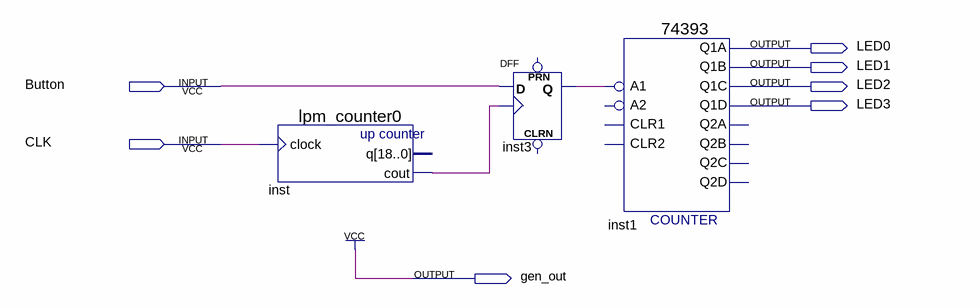
[diagram p0: schematic sheet]
// Quartus schematic 31.bdf as structural Verilog: 3 symbols, 7 pins
module \31  (
  input  Button,
  input  CLK,
  output LED0,
  output LED1,
  output LED2,
  output LED3,
  output gen_out
);

  wire inst3_q, inst_cout;

  lpm_counter0 inst (.clock(CLK), .cout(inst_cout));  // open: q
  DFF inst3 (.CLK(inst_cout), .D(Button), .Q(inst3_q));  // open: CLRN, PRN
  \74393  inst1 (
    .A1(inst3_q), .Q1C(LED2), .Q1D(LED3), .Q1A(LED0), .Q1B(LED1));  // open: CLR1, A2, CLR2, Q2D, Q2C, Q2B, Q2A

  assign gen_out = 1'b1;
endmodule
